# Altium schematic sheet Fri3D_2026_Audio.SchDoc: Audio
size A3; Date: 27/02/2026; DrawnBy: Wim Van Gool; DocumentNumber: 4; Revision: 01; SheetNumber: 4; SheetTotal: 5
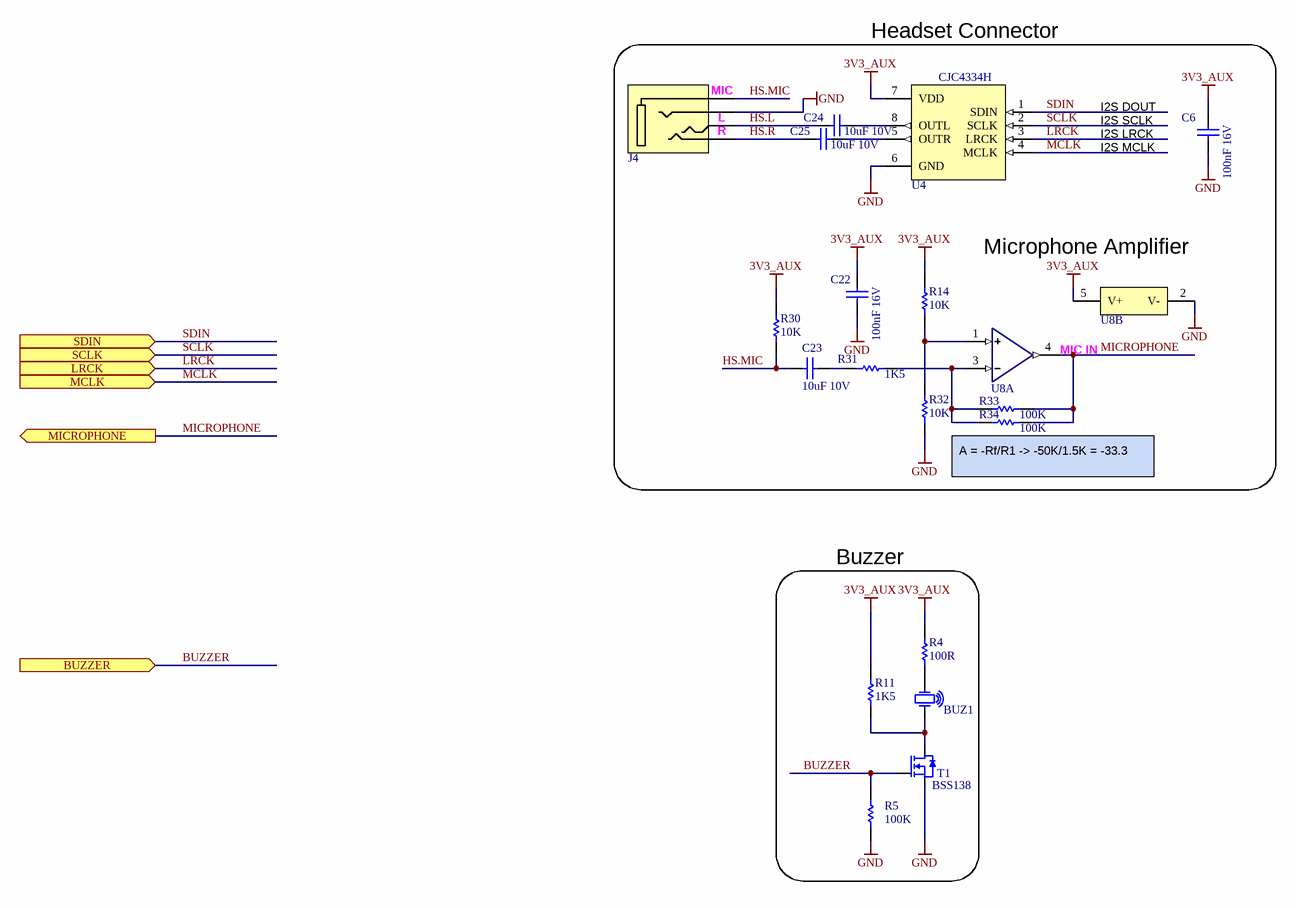
[diagram p0: Fri3D_2026_Audio.SchDoc]

## Parts
BUZ1  12x12x3mm Piezo Buzzer Transducer 81dB  [CUI_CMT-1203-SMT]  (value not drawn)
C6  value 100nF 16V  [C0603_N]
C22  value 100nF 16V  [C0603_N]
C23  value 10uF 10V  [C0805_N]
C24  value 10uF 10V  [C0805_N]
C25  value 10uF 10V  [C0805_N]
J4  3.5mm jack, black, 4 contacts 15mm  [CAX_PJ-327F-5PS]  (value not drawn)
R4  value 100R  [R0603_N]
R5  value 100K  [R0603_N]
R11  value 1K5  [R0603_N]
R14  value 10K  [R0603_N]
R30  value 10K  [R0603_N]
R31  value 1K5  [R0603_N]
R32  value 10K  [R0603_N]
R33  value 100K  [R0603_N]
R34  value 100K  [R0603_N]
T1  value BSS138  [SOT23-3]  (hidden comment: 0.2A N-Ch MOSFET Vgs 3.2)
U4  value CJC4334H  [SOIC_N_8]  (hidden comment: I²S 24bit 192kHz 3V~3.6V DAC)
U8  Single, 30-V, 1-MHz operational amplifier  [TI_DBV_R-PDSO-G5]  (value not drawn)  (parts A,B of 2)

## Blocks framed on the sheet
Buzzer: BUZ1 R4 R5 R11 T1

## Ports
BUZZER (in), LRCK (in), MCLK (in), MICROPHONE (out), SCLK (in), SDIN (in)

## Nets
3V3_AUX: C6.1 C22.1 R4.2 R11.2 R14.1 R30.1 U4.7(VDD) U8.5(V+)
GND: C6.2 C22.2 J4.2(Ring) R5.2 R32.2 T1.2(S) U4.6(GND) U8.2(V-)
BUZZER: R5.1 T1.1(G) ; port BUZZER
HS.L: C24.1 J4.4(Tip)
HS.MIC: C23.1 J4.1(Sleeve) R30.2
HS.R: C25.1 J4.3(Ring)
LRCK: U4.3(LRCK) ; port LRCK
MCLK: U4.4(MCLK) ; port MCLK
MICROPHONE: R33.1 R34.1 U8.4(OUT) ; port MICROPHONE
SCLK: U4.2(SCLK) ; port SCLK
SDIN: U4.1(SDIN) ; port SDIN
NetBUZ1_1: BUZ1.1(OSC1) R11.1 T1.3(D)
NetBUZ1_2: BUZ1.2(OSC2) R4.1
NetC23_2: C23.2 R31.2
NetC24_2: C24.2 U4.8(OUTL)
NetC25_2: C25.2 U4.5(OUTR)
NetR14_2: R14.2 R32.1 U8.1(+)
NetR31_1: R31.1 R33.2 R34.2 U8.3(-)

## Notes on the sheet
- Headset Connector
- (near J4) L
- (near J4) R
- (near J4) MIC
- I2S DOUT
- I2S SCLK
- I2S LRCK
- I2S MCLK
- Microphone Amplifier
- (near U8) MIC IN
- (near R34) A = -Rf/R1 -> -50K/1.5K = -33.3
- Title
- Revision
- Date
- Dranw By
- Size
- A3
- Sheet
- of

## Library data of the parts
BUZ1 = BUZ # CUI CMT-1203-SMT: Crystal Oscillator; Value: CMT-1203-SMT; Supplier 1: Digi-key; Supplier Part Number 1: 102-2197-1-ND; Supplier 2: LCSC; Supplier Part Number 2: C409829; Supplier 3: LCSC; Supplier Part Number 3: C391037
C6 C22 = CAP # 100nF 16V 0603: Capacitor Ceramic; Supplier 1: LCSC; Supplier 3: Generic; Supplier Part Number 1: C282519; Supplier Part Number 3: 100nF 16V 0603 X7R
C23-C25 = CAP # 10uF 10V 0805: Capacitor Ceramic; Supplier 1: Farnell; Supplier Part Number 1: 2320859; Supplier 2: LCSC; Supplier 3: Generic; Supplier Part Number 2: C17024; Supplier Part Number 3: 10uF 10V 0805 X7R
J4 = AUDIO JACK # 3.5 4c 15mm PJ-327F-5PS: Value: PJ-327F-5PS; Supplier 1: LCSC; Supplier Part Number 1: C50176645; Description: AUDIO JACK # 3.5 4c 15mm PJ-327F-5PS
R4 = RES # 100R 0603: Supplier 1: Farnell; Supplier 2: LCSC; Supplier 3: Generic; Supplier Part Number 1: 2446544; Supplier Part Number 2: C22775; Supplier Part Number 3: 100R 1% 0603
R5 R33 R34 = RES # 100K 0603: Supplier 3: Generic; Supplier Part Number 3: 100K 1% 0603; Supplier 1: LCSC; Supplier 2: LCSC; Supplier Part Number 1: C25803; Supplier Part Number 2: C14675
R11 R31 = RES # 1K5 0603: Supplier 3: Generic; Supplier Part Number 3: 1K5 1% 0603; Supplier 1: LCSC; Supplier 2: LCSC; Supplier Part Number 1: C2930050; Supplier Part Number 2: C114668
R14 R30 R32 = RES # 10K 0603: Supplier 1: Farnell; Supplier Part Number 1: 2502397; Supplier 2: LCSC; Supplier 3: Generic; Supplier Part Number 2: C25804; Supplier Part Number 3: 10K 1% 0603
T1 = BSS138 N-Ch MOSFET 0.2A 3.2Vgs 60Vds: Supplier 1: Farnell; Supplier Part Number 1: 2432717
U4 = DAC # I2S CJC4334H: I2S Stereo DAC with 24-Bit, 192 kHz Stereo D/A Converter; Supplier 1: LCSC; Supplier Part Number 1: C41417670
U8 = OP # LM321: =Description; Value: LM321; Supplier 1: LCSC; Supplier Part Number 1: C18164494; Supplier 2: LCSC; Supplier Part Number 2: C51026323; Supplier 3: LCSC; Supplier Part Number 3: C18723612